# EAGLE design openLRSngTX (EAGLE 6.4)
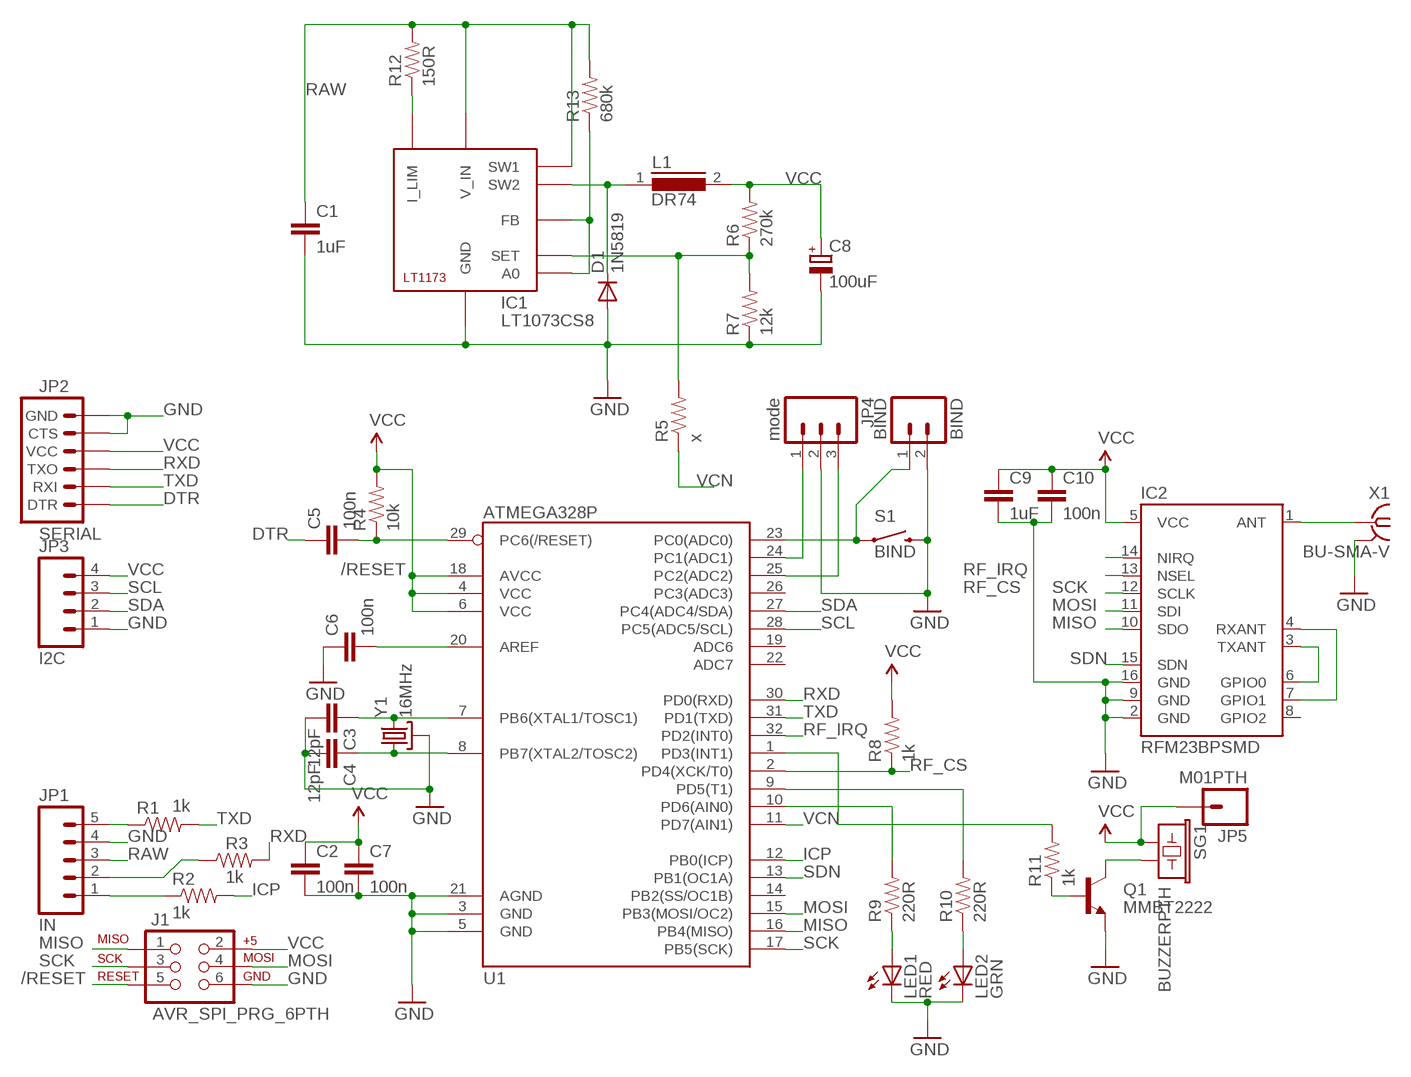
[diagram p0: schematic, sheet 1]

## Parts
BIND  BIND  M02PTH  [1X02]
C1  1uF  CAP0805  [0805]
C2  100n  CAP0805  [0805]
C3  12pF  CAP0805  [0805]
C4  12pF  CAP0805  [0805]
C5  100n  CAP0805  [0805]
C6  100n  CAP0805  [0805]
C7  100n  CAP0805  [0805]
C8  100uF  CPOL-EUD/7343-31W  [D/7343-31W]
C9  1uF  CAP0805  [0805]
C10  100n  CAP0805  [0805]
D1  1N5819  DIODE-DO214AC  [DO214AC]
IC1  LT1073CS8  LT1173CS8  [SOIC8]
IC2  RFM23BPSMD  [RFM23BP-S2]
J1  AVR_SPI_PRG_6PTH  [2X3]
JP1  IN  M05PTH  [1X05]
JP2  SERIAL  ARDUINO_SERIAL_PROGRAMPTH  [1X06]
JP3  I2C  M04PTH  [1X04]
JP4  mode  M03PTH  [1X03]
JP5  M01PTH  [1X01]
L1  DR74  [DR74]
LED1  RED  LED3MM  [LED3MM]
LED2  GRN  LED3MM  [LED3MM]
Q1  MMBT2222  TRANSISTOR_NPNSOT23-3  [SOT23-3]
R1  1k  RESISTOR0805-RES  [0805]
R2  1k  RESISTOR0805-RES  [0805]
R3  1k  RESISTOR0805-RES  [0805]
R4  10k  RESISTOR0805-RES  [0805]
R5  x  RESISTOR0805-RES  [0805]
R6  270k  RESISTOR0805-RES  [0805]
R7  12k  RESISTOR0805-RES  [0805]
R8  1k  RESISTOR0805-RES  [0805]
R9  220R  RESISTOR0805-RES  [0805]
R10  220R  RESISTOR0805-RES  [0805]
R11  1k  RESISTOR0805-RES  [0805]
R12  150R  RESISTOR0805-RES  [0805]
R13  680k  RESISTOR0805-RES  [0805]
S1  BIND  SWITCH-MOMENTARY-2  [TACTILE_SWITCH_TALL]
SG1  BUZZERPTH  [BUZZER-12MM]
U1  ATMEGA328P  ATMEGA328_SMT  [TQFP32-08]
X1  BU-SMA-V  [BU-SMA-V]
Y1  16MHz  CRYSTAL3.2X2.5  [CRYSTAL-SMD-5X3]

## Nets
/RESET: C5.2 J1.5 R4.1 U1.29(PC6(/RESET))
DTR: C5.1 JP2.1(DTR)
GND: BIND.2 C1.2 C2.2 C3.2 C4.2 C6.1 C7.2 C8.- C9.2 C10.2 D1.A IC1.5(GND) IC2.2(GND) IC2.9(GND) IC2.16(GND) J1.6 JP1.4 JP2.5(CTS) JP2.6(GND) JP3.1 JP4.2 LED1.K(C) LED2.K(C) Q1.2(E) R7.1 S1.B2 U1.3(GND) U1.5(GND) U1.21(AGND) X1.2 X1.3 X1.4 X1.5 Y1.2(GND) Y1.4(GND)
ICP: R2.2 U1.12(PB0(ICP))
MISO: IC2.10(SDO) J1.1 U1.16(PB4(MISO))
MOSI: IC2.11(SDI) J1.4 U1.15(PB3(MOSI/OC2))
N$1: IC2.3(TXANT) IC2.6(GPIO0)
N$2: IC2.4(RXANT) IC2.7(GPIO1)
N$3: JP1.1 R2.1
N$4: R11.2 U1.1(PD3(INT1))
N$5: Q1.1(B) R11.1
N$6: Q1.3(C) SG1.-
N$7: R9.2 U1.10(PD6(AIN0))
N$8: R10.2 U1.9(PD5(T1))
N$9: LED2.A R10.1
N$10: LED1.A R9.1
N$11: C3.1 U1.7(PB6(XTAL1/TOSC1)) Y1.3
N$12: C4.1 U1.8(PB7(XTAL2/TOSC2)) Y1.1
N$13: IC2.1(ANT) X1.1
N$14: C6.2 U1.20(AREF)
N$15: BIND.1 S1.A2 U1.23(PC0(ADC0))
N$16: IC1.1(I_LIM) R12.1
N$17: JP1.2 R3.1
N$18: JP4.1 U1.24(PC1(ADC1))
N$19: JP4.3 U1.25(PC2(ADC2))
N$20: JP1.5 R1.1
N$21: D1.C IC1.4(SW2) L1.1
N$22: IC1.6(A0) IC1.8(FB) R13.1
N$25: IC1.7(SET) R5.2 R6.1 R7.2
RAW: C1.1 IC1.2(V_IN) IC1.3(SW1) JP1.3 R12.2 R13.2
RF_CS: IC2.13(NSEL) R8.1 U1.2(PD4(XCK/T0))
RF_IRQ: IC2.14(NIRQ) U1.32(PD2(INT0))
RXD: JP2.3(TXO) R3.2 U1.30(PD0(RXD))
SCK: IC2.12(SCLK) J1.3 U1.17(PB5(SCK))
SCL: JP3.3 U1.28(PC5(ADC5/SCL))
SDA: JP3.2 U1.27(PC4(ADC4/SDA))
SDN: IC2.15(SDN) U1.13(PB1(OC1A))
TXD: JP2.2(RXI) R1.2 U1.31(PD1(TXD))
VCC: C2.1 C7.1 C8.+ C9.1 C10.1 IC2.5(VCC) J1.2 JP2.4(VCC) JP3.4 JP5.1 L1.2 R4.2 R6.2 R8.2 SG1.+ U1.4(VCC) U1.6(VCC) U1.18(AVCC)
VCN: R5.1 U1.11(PD7(AIN1))
Unconnected: IC2.8(GPIO2) U1.14(PB2(SS/OC1B)) U1.19(ADC6) U1.22(ADC7) U1.26(PC3(ADC3))

## Library data of the parts
BIND = SparkFun-Connectors:M02: Header 2 Standard 2-pin 0.1" header. Use with straight break away headers (SKU : PRT-00116), right angle break away headers (PRT-00553), swiss pins (PRT-00743), machine pins (PRT-00117), and female headers (PRT-00115). Molex polarized connector foot print use with SKU : PRT-08233 with associated crimp pins and housings.
C1-C7 C9 C10 = SparkFun-Capacitors:CAP: Capacitor Standard 0603 ceramic capacitor, and 0.1" leaded capacitor.
C8 = rcl:CPOL-EU: POLARIZED CAPACITOR, European symbol
D1 = diode:DIODE-: DIODE
IC1 = ltc_swr:LT1173: LT1173 - Micropower DC/DC Converter Adjustable and Fixed 5V, 12V Operates at Supply Voltages From 2.0V to 30V Consumes Only 110µA Supply Current Works in Step-Up or Step-Down Mode Only Three External Components Required Low Battery Detector Comparator On-Chip User-Adjustable Current Limit Internal 1A Power Switch Fixed or Adjustable Output Voltage Versions Space Saving 8-Pin MiniDIP or SO8 Package
IC2 = RFM23:RFM23BP: The RFM23BP is a medium power, low cost radio that is capable of operating in the 434MHz and 900MHz open bands. It's frequency is software defined and there are some very good libraries written for it.
J1 = SparkFun-Connectors:AVR_SPI_PRG_6: AVR ISP 6 Pin This is the reduced ISP connector for AVR programming. Common on Arduino. This footprint will take up less PCB space and can be used with a 10-pin to 6-pin adapter such as SKU: BOB-08508
JP1 = SparkFun-Connectors:M05: Header 5 Standard 5-pin 0.1" header. Use with straight break away headers (SKU : PRT-00116), right angle break away headers (PRT-00553), swiss pins (PRT-00743), machine pins (PRT-00117), and female headers (PRT-00115). Molex polarized connector foot print use with SKU : PRT-08230 with associated crimp pins and housings.
JP2 = SparkFun-Connectors:ARDUINO_SERIAL_PROGRAM: FTDI connector footprints
JP3 = SparkFun-Connectors:M04: Header 4 Standard 4-pin 0.1" header. Use with straight break away headers (SKU : PRT-00116), right angle break away headers (PRT-00553), swiss pins (PRT-00743), machine pins (PRT-00117), and female headers (PRT-00115). Molex polarized connector foot print use with SKU : PRT-08231 with associated crimp pins and housings. 1MM SMD Version SKU: PRT-10208
JP4 = SparkFun-Connectors:M03: Header 3 Standard 3-pin 0.1" header. Use with straight break away headers (SKU : PRT-00116), right angle break away headers (PRT-00553), swiss pins (PRT-00743), machine pins (PRT-00117), and female headers (PRT-00115). Molex polarized connector foot print use with SKU : PRT-08232 with associated crimp pins and housings.
JP5 = SparkFun-Connectors:M01: Header 1 Standard 1-pin 0.1" header. Use with straight break away headers (SKU : PRT-00116), right angle break away headers (PRT-00553), swiss pins (PRT-00743), machine pins (PRT-00117), and female headers (PRT-00115).
L1 = inductors:DR74: High Power Density, High Efficiency, Shielded Inductors Source: coiltronics_dr_series.pdf
LED1 LED2 = SparkFun-LED:LED: LEDs Standard schematic elements and footprints for 5mm, 3mm, 1206, and 0603 sized LEDs. 5mm - Spark Fun Electronics SKU : COM-00529 (and others)
Q1 = SparkFun-DiscreteSemi:TRANSISTOR_NPN: Generic NPN BJT. MMBT2222 is the common NPN we use. Double check against datasheet- not all devices are the same!
R1-R13 = SparkFun-Resistors:RESISTOR: Resistor Basic schematic elements and footprints for 0603, 1206, and PTH resistors.
S1 = SparkFun-Electromechanical:SWITCH-MOMENTARY-2: Various NO switches- pushbuttons, reed, etc
SG1 = SparkFun-Electromechanical:BUZZER: Buzzer 12mm Spark Fun Electronics SKU : Comp-Buzzer
U1 = SparkFun-DigitalIC:ATMEGA328_SMT: 32-Pin Atmega328 part Commonly used on Arduino compatible boards Available in QFP and QFN packages TQFP is IC-09069 QFN is non-stock; PROD_ID: IC-09069
X1 = con-coax:BU-SMA-V: FEMALE SMA CONNECTOR Radiall distributor RS 112-3794; OC_FARNELL: unknown; OC_NEWARK: unknown
Y1 = crystal_3225:CRYSTAL: Various standard crystals. Proven footprints. Spark Fun Electronics SKU : COM-00534

## Board
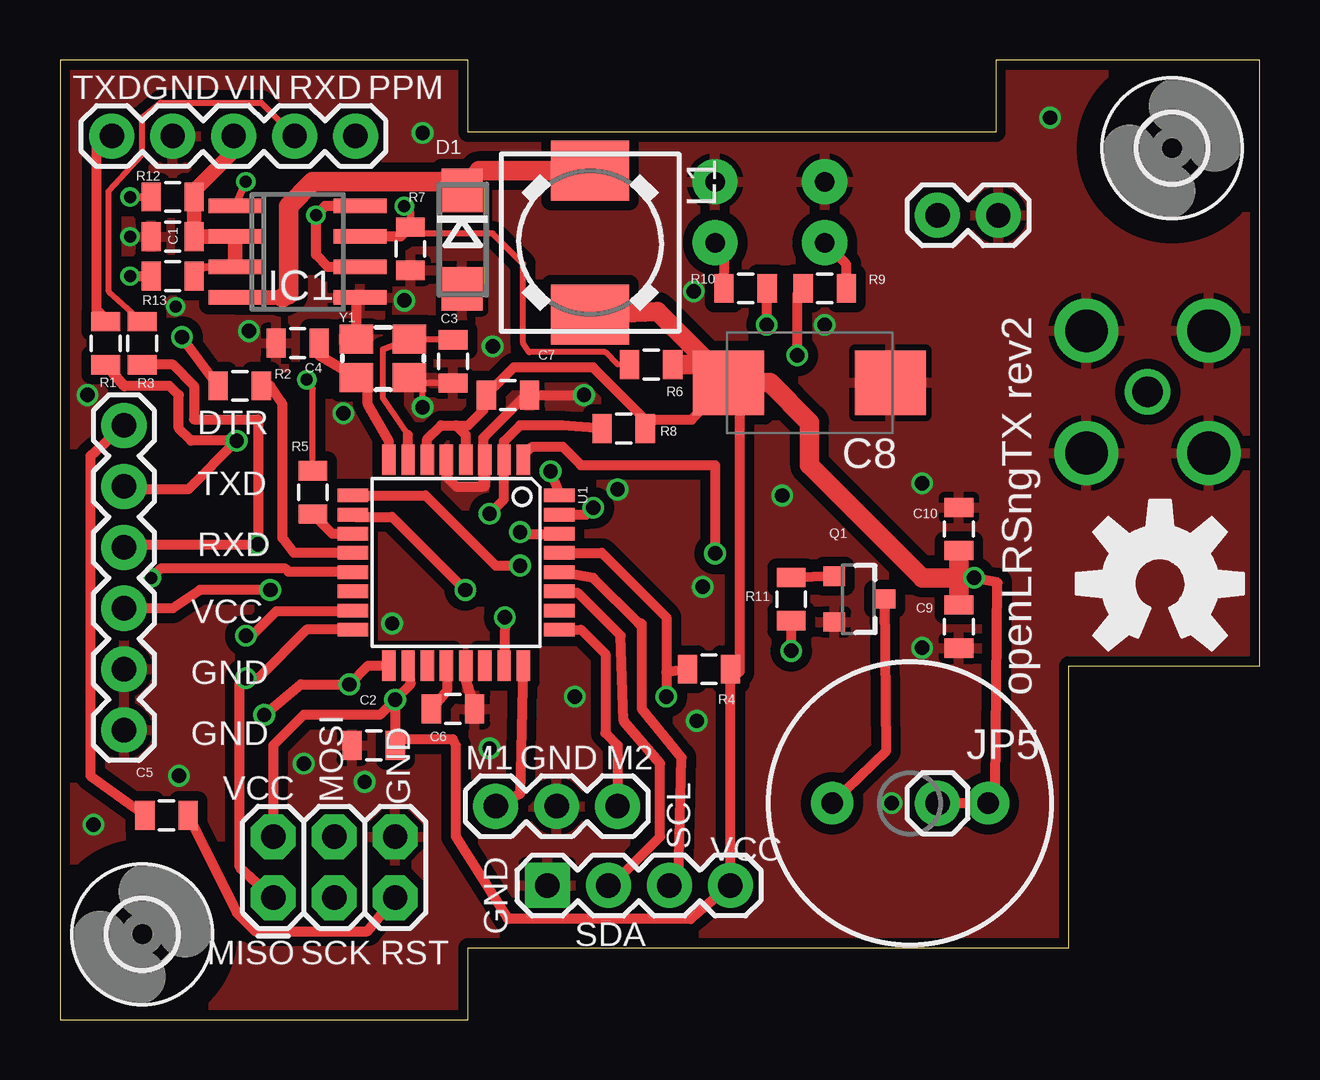
[diagram p1: board, top side]
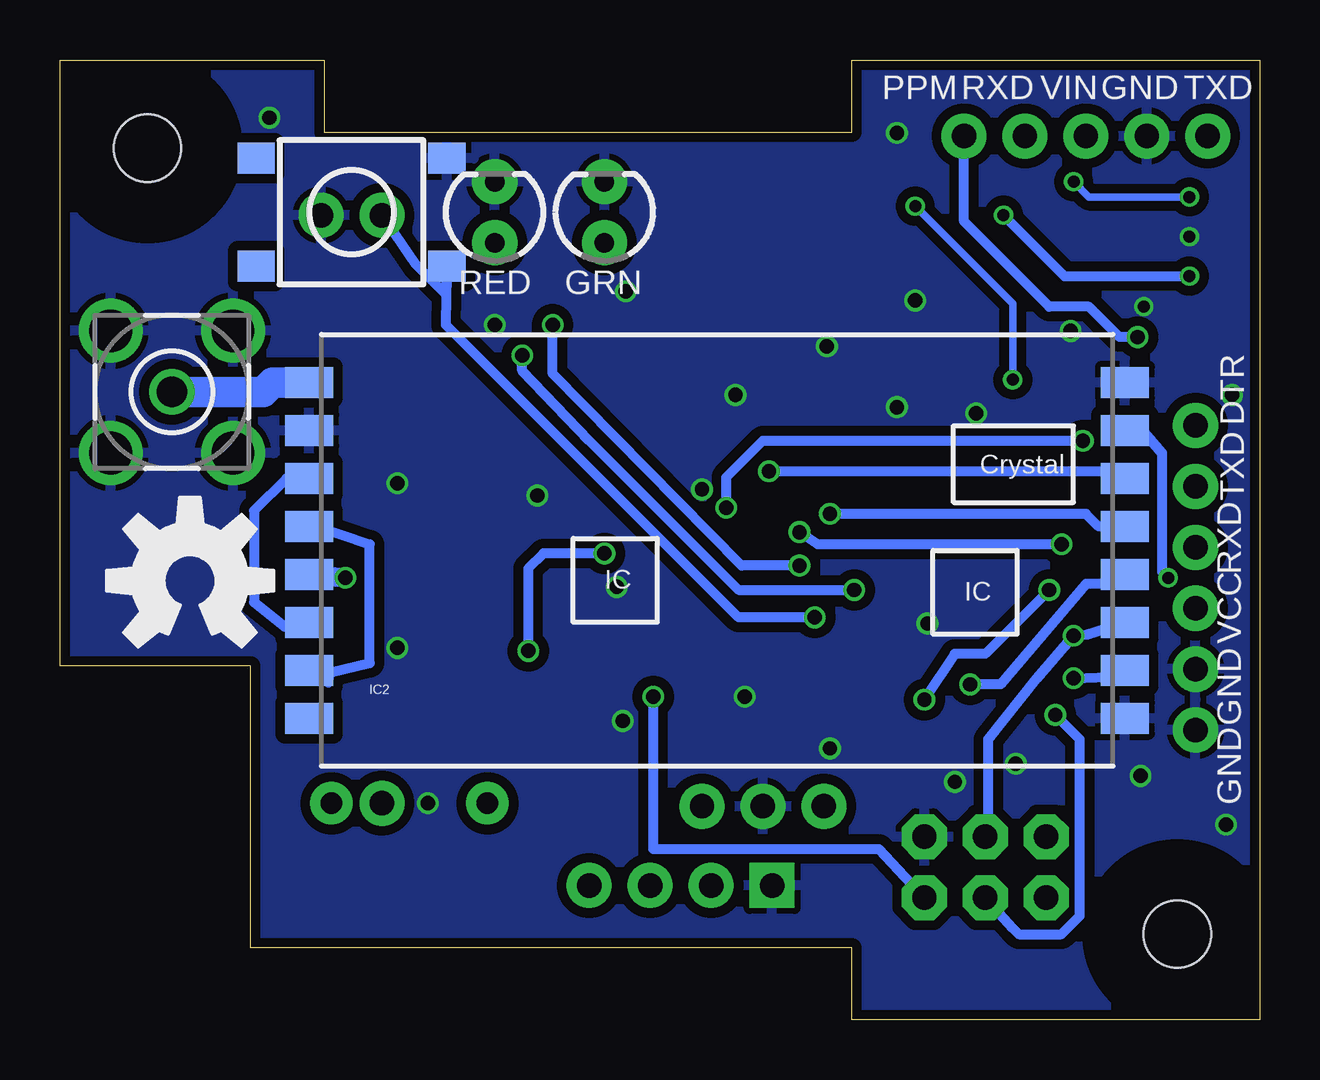
[diagram p2: board, bottom side, seen from below]

Size 50 x 40 mm. Coordinates in mm from the lower left corner, seen from the top.
Outline: 0,0 17,0 17,3 42.05,3 42.05,14.73 50,14.73 50,40 39,40 39,37 17,37 17,40 0,40 0,0
Copper layers (1*16): Top 0.035mm / dielectric 1.5mm / Bottom 0.035mm
Design rules "ITEADstudio_DRC": minimum track width 6mil, minimum drill 12mil, track to track 6mil, track to pad 6mil, pad to pad 6mil, via to via 6mil, smd to smd 0mil, copper to edge 10mil, drill to drill 10mil, minimum pad ring 10mil, minimum via ring 6mil, stop-mask expansion 2mil, vias tented up to drill 100mil, thermal gap 10mil

### Footprints (pad centres in the part's own frame; a part is rotated, then mirrored left to right if it is on the bottom)
1X02 = drill 1.016 pad 1.88: 1 0,0; 2 2.54,0
0805 = smd 0.8 x 1.2: 1 -0.9,0; 2 0.9,0
D/7343-31W = smd 2.95 x 2.7: + 3.375,0; - -3.375,0
DO214AC = smd 1.8 x 1.7: A 2.05,0; C -2.05,0
SOIC8 = smd 0.6 x 2.2: 1 -1.905,-2.6; 2 -0.635,-2.6; 3 0.635,-2.6; 4 1.905,-2.6; 5 1.905,2.6; 6 0.635,2.6; 7 -0.635,2.6; 8 -1.905,2.6
RFM23BP-S2 = smd 2 x 1.3: 1 -17,7; 2 -17,5; 3 -17,3; 4 -17,1; 5 -17,-1; 6 -17,-3; 7 -17,-5; 8 -17,-7; 9 17,-7; 10 17,-5; 11 17,-3; 12 17,-1; 13 17,1; 14 17,3; 15 17,5; 16 17,7
2X3 = drill 1.016 pad 1.88 octagon: 1 0,0; 2 0,2.54; 3 2.54,0; 4 2.54,2.54; 5 5.08,0; 6 5.08,2.54
1X05 = drill 1.016 pad 1.88: 1 0,0; 2 2.54,0; 3 5.08,0; 4 7.62,0; 5 10.16,0
1X06 = drill 1.016 pad 1.88: 1 0,0; 2 2.54,0; 3 5.08,0; 4 7.62,0; 5 10.16,0; 6 12.7,0
1X04 = drill 1.016 pad 1.88 square: 1 0,0 | drill 1.016 pad 1.88: 2 2.54,0; 3 5.08,0; 4 7.62,0
1X03 = drill 1.016 pad 1.88: 1 0,0; 2 2.54,0; 3 5.08,0
1X01 = drill 1.016 pad 1.88: 1 0,0
DR74 = smd 2.5 x 3.25: 1 -3,0; 2 3,0
LED3MM = drill 0.813 pad 1.88: A -1.27,0; K 1.27,0
SOT23-3 = smd 0.8 x 0.9: 1 -0.95,-1; 2 0.95,-1; 3 0,1.1
TACTILE_SWITCH_TALL = smd 1.55 x 1.3: A1 -3.975,-2.25; A2 3.975,-2.25; B1 -3.975,2.25; B2 3.975,2.25
BUZZER-12MM = drill 0.9 pad 1.778: + 3.25,0; - -3.25,0
TQFP32-08 = smd 1.27 x 0.559: 1 -4.293,2.8; 2 -4.293,2; 3 -4.293,1.2; 4 -4.293,0.4; 5 -4.293,-0.4; 6 -4.293,-1.2; 7 -4.293,-2; 8 -4.293,-2.8; 17 4.293,-2.8; 18 4.293,-2; 19 4.293,-1.2; 20 4.293,-0.4; 21 4.293,0.4; 22 4.293,1.2; 23 4.293,2; 24 4.293,2.8 | smd 0.559 x 1.27: 9 -2.8,-4.293; 10 -2,-4.293; 11 -1.2,-4.293; 12 -0.4,-4.293; 13 0.4,-4.293; 14 1.2,-4.293; 15 2,-4.293; 16 2.8,-4.293; 25 2.8,4.293; 26 2,4.293; 27 1.2,4.293; 28 0.4,4.293; 29 -0.4,4.293; 30 -1.2,4.293; 31 -2,4.293; 32 -2.8,4.293
2,8 = hole 2.8: 0,0
BU-SMA-V = drill 1.27: 1 0,0 | drill 1.778: 2 -2.55,2.55; 3 2.55,2.55; 4 2.55,-2.55; 5 -2.55,-2.55
CRYSTAL-SMD-5X3 = smd 1.4 x 1.2: 1 -1.1,-0.8; 2 1.1,-0.8; 3 1.1,0.8; 4 -1.1,0.8

### Placement (x,y rotation side)
BIND  36.58,33.53 0 top
C1  4.7,32.64 180 top
C2  13.08,11.43 180 top
C3  16.38,27.43 270 top
C4  9.91,28.19 180 top
C5  4.45,8.51 0 top
C6  16.38,12.95 180 top
C7  18.67,26.04 0 top
C8  31.24,26.54 180 top
C9  37.46,16.38 270 top
C10  37.46,20.45 90 top
D1  16.76,32.51 270 top
IC1  9.91,32 270 top
IC2  22.61,19.56 0 bottom
J1  8.89,5.08 0 top
JP1  12.32,36.83 180 top
JP2  2.67,24.77 270 top
JP3  20.32,5.59 0 top
JP4  18.16,8.89 0 top
JP5  36.58,9.02 0 top
L1  22.1,32.38 270 top
LED1  31.88,33.66 90 bottom
LED2  27.31,33.66 90 bottom
Q1  33.27,17.53 270 top
R1  1.91,28.19 270 top
R2  7.49,26.42 0 top
R3  3.43,28.19 270 top
R4  27.05,14.61 0 top
R5  10.54,21.97 90 top
R6  24.64,27.3 0 top
R7  14.61,32.13 90 top
R8  23.5,24.64 0 top
R9  31.88,30.48 180 top
R10  28.58,30.48 0 top
R11  30.48,17.53 270 top
R12  4.7,34.29 0 top
R13  4.7,30.99 0 top
S1  37.85,33.66 0 bottom
SG1  35.43,9.02 0 top
U1  16.51,19.05 270 top
U$1  [OSHW-LOGO-L]  44.58,18.29 0 bottom
U$2  [OSHW-LOGO-L]  45.85,18.16 0 top
U$3  [2,8]  3.43,3.56 0 top
U$4  [2,8]  46.35,36.32 0 top
X1  45.34,26.16 0 bottom
Y1  13.46,27.56 0 top

### Tracks (layer width: path | path; a pad name or v marks a point on that pad's centre or on a via)
/RESET  (via drill 0.6)
  Top 0.406: C5.2 7.37,4.45 8.13,3.68 12.83,3.68 J1.5 | U1.29 22.59,19.45 25.27,16.76 25.27,14.48 | 25.27,14.48 v25.27,13.46 | R4.1 25.27,14.48
  Bottom 0.406: v25.27,13.46 25.27,7.11 15.88,7.11 J1.5
DTR
  Top 0.406: JP2.1 1.27,23.5 1.27,10.16 C5.1
GND  (via drill 0.5, 0.6)
  Top 0.254: C3.2 14.79,26.53 Y1.2 15.11,26.21 v15.11,25.53
  Top 0.406: U1.3 17.71,22.23 17.65,22.23 | v21.84,26.04 C7.2 19.43,26.04 17.65,24.26 17.65,22.23 | U1.21 16.89,14.22 C6.1 | U1.5 16.11,22.62 16.51,22.23 17.65,22.23 | Y1.4 12.36,29.95 IC1.5
  other vias: 17.91,11.3 35.94,22.35 26.42,30.35 34.67,9.02 35.94,15.49 4.95,10.16 26.54,12.45 26.8,18.03 1.14,26.04 23.24,22.1 30.1,21.84 21.46,13.46 1.4,8.13 41.27,37.59 11.81,25.27 13.84,16.51 14.35,29.97 7.87,28.7 18.03,28.07 31.88,28.96 15.11,36.96 12.7,9.91 10.16,10.67 2.92,32.64 4.83,29.72
  pour Bottom (isolate 0.406): 0,41.27 53.34,41.27 53.34,-0.64 52.7,-1.27 0,-1.27
  pour Top (isolate 0.406, rank 2): -1.91,41.91 52.7,41.91 53.98,40.64 53.98,0 52.7,-1.27 -1.91,-1.27
ICP
  Top 0.406: U1.12 9.76,19.45 9.27,20.07 9.27,25.65 8.76,26.42 R2.2
MISO  (via drill 0.6)
  Top 0.406: U1.16 10.29,16.26 8.26,14.22 v7.75,14.22 7.49,14.05 7.49,6.35 J1.1
  Bottom 0.406: v7.75,14.22 5.79,14.3 IC2.10
MOSI  (via drill 0.6)
  Top 0.406: U1.15 12.19,17.02 9.02,17.02 8,16 v7.75,16
  Bottom 0.406: IC2.11 7.19,16.05 v7.75,16 9.27,14.22 11.3,11.68 11.3,7.75 J1.4
N$1
  Bottom 0.406: IC2.3 40.56,22.56 41.91,21.21 41.91,17.4 40.64,16.38 40.03,16.38 IC2.6
N$2
  Bottom 0.406: IC2.7 38.81,14.05 38.73,14.48 37.08,14.86 37.08,19.81 39.37,20.57 39.59,20.32 IC2.4
N$3  (via drill 0.6)
  Top 0.406: R2.1 v5.08,28.45
  Bottom 0.406: v5.08,28.45 5.84,28.45 7.11,29.72 8.76,29.72 12.32,33.27 JP1.1
N$4  (via drill 0.6)
  Top 0.406: U1.1 19.31,23.5 19.69,23.88 20.96,23.88 21.72,23.11 27.31,23.11 v27.31,19.43 | v30.48,15.37 R11.2
  Bottom 0.406: v27.31,19.43 29.85,19.43 30.48,18.8 v30.48,15.37
N$5
  Top 0.406: Q1.1 R11.1
N$6
  Top 0.406: Q1.3 34.42,11.18 SG1.-
N$7  (via drill 0.6)
  Top 0.406: U1.10 12.31,20.95 13.84,20.95 v16.89,17.91 | v30.73,27.69 30.73,30.24 R9.2
  Bottom 0.406: v16.89,17.91 21.72,17.91 27.94,24.13 30.73,27.05 v30.73,27.69
N$8  (via drill 0.6)
  Top 0.406: v29.46,28.96 R10.2 | U1.9 15.23,21.85 18.16,18.92 v19.18,18.92
  Bottom 0.406: v19.18,18.92 21.59,18.92 29.46,26.92 v29.46,28.96
N$9
  Top 0.406: R10.1 27.7,31.74 LED2.A
N$10
  Top 0.406: R9.1 32.78,31.48 LED1.A
N$11
  Top 0.254: 14.51,24.38 13.46,25.91 13.46,27.94 Y1.3 16.03,28.36 C3.1
  Top 0.406: U1.7 14.51,24.38
N$12
  Top 0.406: U1.8 13.71,24.09 12.83,25.65 12.83,26.76 Y1.1 10.79,27.69 C4.1
N$13
  Bottom 1.27: IC2.1 41.13,26.56 41.53,26.16 X1.1
N$14
  Top 0.406: U1.20 16.13,14.74 16.13,13.72 C6.2
N$15  (via drill 0.6)
  Top 0.406: v18.54,16.76 U1.23
  Bottom 0.406: v18.54,16.76 21.72,16.76 33.91,28.96 S1.A2 33.91,30.23 35.18,31.5 BIND.1
N$16  (via drill 0.5)
  Top 0.305: IC1.1 v7.75,34.92 | v2.92,34.29 R12.1
  Bottom 0.305: v7.75,34.92 7.11,34.29 v2.92,34.29
N$17
  Top 0.254: JP1.2 8.38,38.23 4.19,38.23 3.43,37.59 3.43,36.07 2.03,34.54 2.03,30.35 R3.1
N$18
  Top 0.406: U1.24 19.18,9.4 JP4.1
N$19
  Top 0.406: U1.25 21.72,16.26 22.73,15.24 22.73,11.94 23.24,11.43 JP4.3
N$20
  Top 0.406: R1.1 1.91,29.21 1.52,29.59 1.52,36.32 JP1.5
N$21
  Top 0.61: IC1.4 9.27,30.1 | 16.4,34.92 D1.C
  Top 0.813: 9.27,30.1 9.53,30.23 9.53,33.91 10.54,34.92 16.4,34.92 | L1.1 17.46,35.38 D1.C
N$22  (via drill 0.5)
  Top 0.406: IC1.8 11.05,33.91 v10.67,33.53 10.67,31.88 11.18,31.37 IC1.6 | v2.92,30.99 R13.1
  Bottom 0.406: v10.67,33.53 8.13,30.99 v2.92,30.99
N$25  (via drill 0.5)
  Top 0.254: R6.1 23.24,27.3 22.73,27.81 19.56,27.81 19.3,28.19 19.3,31.5 18.03,32.77 14.87,32.77 R7.2 14.59,33.03 | R5.2 10.54,26.29 v10.29,26.67
  Top 0.305: v14.35,33.91 14.61,33.66 R7.2
  Top 0.406: 14.59,33.03 14.2,32.64 IC1.7
  Bottom 0.305: v10.29,26.67 10.29,29.84 v14.35,33.91
RAW
  Top 0.305: R13.2 5.98,31.37 IC1.3
  Top 0.61: JP1.3 7.24,36.2 5.6,34.55 R12.2 C1.1 IC1.2 IC1.3
RF_CS  (via drill 0.6)
  Top 0.406: R8.1 20.94,24.77 19.18,24.77 18.51,24.1 U1.2 18.51,21.68 v17.91,21.08
  Bottom 0.406: IC2.13 6.71,20.56 7.24,21.08 v17.91,21.08
RF_IRQ  (via drill 0.6)
  Top 0.406: U1.32 20.8,22 v20.45,22.86
  Bottom 0.406: v20.45,22.86 5.91,22.86 IC2.14
RXD  (via drill 0.6)
  Top 0.406: JP2.3 3.3,19.81 v8.26,19.81 8.26,25.02 5.59,25.02 5.59,26.42 4.71,27.29 R3.2 | v19.18,20.32 19.25,20.25 U1.30
  Bottom 0.406: v8.26,19.81 18.42,19.81 v19.18,20.32
SCK  (via drill 0.6)
  Top 0.406: U1.17 12.85,14.76 v12.06,13.97 10.03,13.97 v8.51,12.7
  Bottom 0.406: v12.06,13.97 10.79,13.97 7.24,18.16 5.88,18.16 IC2.12 | J1.3 10.29,3.81 10.03,3.56 8.26,3.56 7.49,4.32 7.49,11.68 v8.51,12.7
SCL
  Top 0.406: JP3.3 25.4,5.46 25.78,5.84 25.91,10.92 24.26,12.95 24.26,16.51 24.13,16.51 22.23,18.41 U1.28
SDA
  Top 0.406: JP3.2 22.99,5.59 25.02,7.62 25.02,10.67 23.5,12.45 23.37,16 21.59,17.78 U1.27
SDN  (via drill 0.5)
  Top 0.406: U1.13 12.2,18.67 9.53,18.67 9.4,18.8 4.19,18.8 v3.81,18.41
  Bottom 0.305: IC2.15 5.61,24.62 5.59,24.64
  Bottom 0.406: 5.59,24.64 4.95,24.64 4.06,23.62 4.06,18.67 v3.81,18.41
TXD  (via drill 0.6)
  Top 0.406: U1.31 21.94,21.05 v22.23,21.34 | JP2.2 3.3,22.1 5.33,22.1 v7.37,24.13 5.46,24.13 4.95,24.64 4.95,26.04 4.57,26.42 2.68,26.41 R1.2
  Bottom 0.406: v22.23,21.34 22.23,22.61 20.7,24.13 v7.37,24.13
VCC  (via drill 0.6)
  Top 0.406: U1.6 15.31,24.2 15.88,24.77 16.51,24.77 | 16.51,24.77 16.91,24.36 U1.4 | U1.18 14.61,13.97 v13.97,13.34 | v13.97,13.34 13.33,12.7 10.16,12.7 8.89,11.43 J1.2 | v38.1,18.41 39.08,18.21 38.99,9.65 SG1.+ JP5.1 | R8.2 24.4,25.01 | 24.4,25.01 22.23,27.18 18.91,27.18 C7.1 17.65,25.92 17.65,25.4 17.02,24.77 16.51,24.77 | 24.4,25.01 26.33,25.01 C8.+ 28.32,26.54 28.32,14.48 R4.2 JP3.4 26.29,4.19 18.67,4.19 16.51,7.62 16.51,11.43 16.38,11.68 14.23,11.68 C2.1 13.97,11.44 v13.97,13.34 | v8.76,17.91 5.84,17.91 4.7,17.14 JP2.4
  Top 0.813: 37.46,18.41 v38.1,18.41 | C10.1 37.46,18.41 | C9.1 37.46,18.41 | 37.46,18.41 35.94,18.41 31.24,23.11 31.24,24.89 29.59,26.54 C8.+ | C8.+ 27.87,26.62 | 21.64,29.34 L1.2 24.9,29.51 27.11,27.3 | C8.+ 27.11,27.3 | 27.11,27.3 R6.2
  Bottom 0.406: v8.76,17.91 11.43,15.24 12.7,15.24 v13.97,13.34
  Bottom 0.813: v38.1,18.41 IC2.5
VCN
  Top 0.406: U1.11 11.36,20.25 R5.1

### Text on the board
tNames: TXD | GND | VIN | RXD | PPM | openLRSngTX rev2 | DTR | TXD | RXD | VCC | GND | MOSI | GND | GND | VCC | M1 | GND | M2 | VCC | SCL | GND | MISO | SDA | SCK | RST
bNames: TXD | GND | VIN | RXD | PPM | GRN | RED | DTR | TXD | RXD | VCC | GND | GND